# Altium schematic sheet Top Level.SchDoc
size A
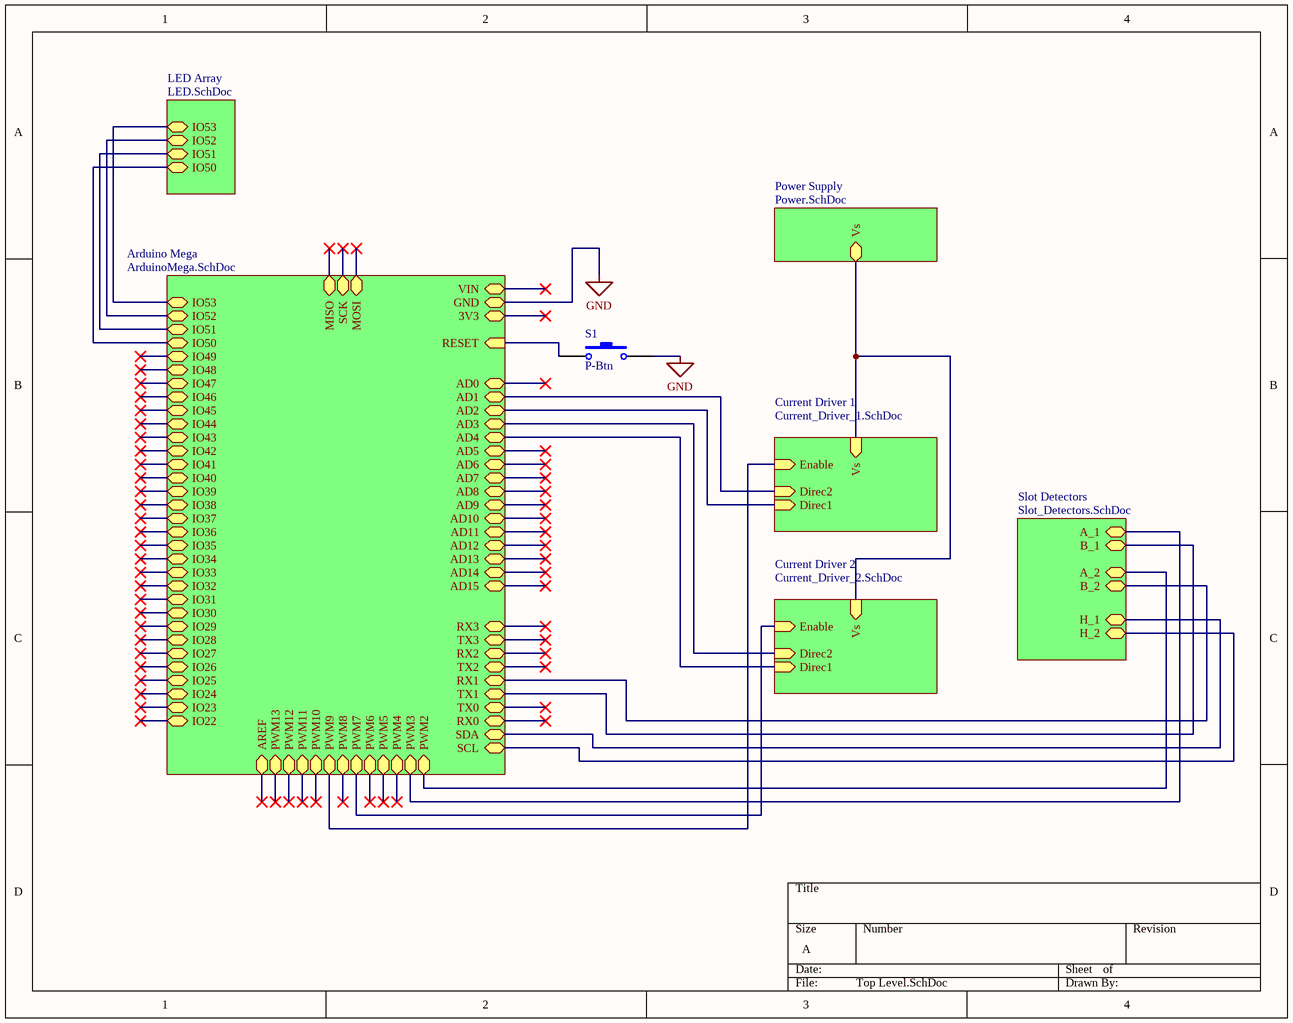
[diagram p0: Top Level.SchDoc]

## Parts
S1  P-Btn  [SPST-2_LGE1.0]

## Sub-sheets
Arduino Mega = ArduinoMega.SchDoc: AD9 (bidir), AD8 (bidir), AD12 (bidir), AD10 (bidir), AD14 (bidir), AD15 (bidir), AD13 (bidir), AD11 (bidir), AD0 (bidir), AD1 (bidir), AD2 (bidir), AD6 (bidir), AD3 (bidir), AD7 (bidir), AD4 (bidir), AD5 (bidir), GND, 3V3, VIN, RESET (in), RX3 (bidir), SDA (bidir), TX2 (bidir), TX0 (bidir), RX0 (bidir), TX1 (bidir), TX3 (bidir), RX1 (bidir), RX2 (bidir), SCL (bidir), MISO (bidir), SCK (bidir), MOSI (bidir), IO52 (bidir), IO50 (bidir), IO51 (bidir), IO53 (bidir), IO46 (bidir), IO44 (bidir), IO45 (bidir), IO43 (bidir), IO41 (bidir), IO47 (bidir), IO49 (bidir), IO42 (bidir), IO40 (bidir), IO48 (bidir), IO33 (bidir), IO34 (bidir), IO32 (bidir), IO29 (bidir), IO39 (bidir), IO31 (bidir), IO28 (bidir), IO27 (bidir), IO25 (bidir), IO23 (bidir), IO30 (bidir), IO26 (bidir), IO22 (bidir), IO24 (bidir), IO38 (bidir), IO35 (bidir), IO37 (bidir), IO36 (bidir), PWM2 (bidir), PWM11 (bidir), PWM8 (bidir), PWM12 (bidir), PWM10 (bidir), PWM13 (bidir), PWM7 (bidir), PWM4 (bidir), PWM5 (bidir), PWM6 (bidir), PWM3 (bidir), AREF (bidir), PWM9 (bidir)
Current Driver 1 = Current_Driver_1.SchDoc: Enable (in), Direc2 (in), Direc1 (in), Vs (in)
Current Driver 2 = Current_Driver_2.SchDoc: Direc1 (in), Enable (in), Direc2 (in), Vs (in)
LED Array = LED.SchDoc: IO53 (bidir), IO52 (bidir), IO51 (bidir), IO50 (bidir)
Power Supply = Power.SchDoc: Vs
Slot Detectors = Slot_Detectors.SchDoc: A_1 (bidir), B_1 (bidir), A_2 (bidir), B_2 (bidir), H_1, H_2

## Nets
GND: S1.2 ; sheet Arduino Mega/GND
NetS1_1: S1.1 ; sheet Arduino Mega/RESET
(unnamed): sheet Current Driver 1/Enable, sheet Arduino Mega/PWM9
(unnamed): sheet Current Driver 1/Direc2, sheet Arduino Mega/AD1
(unnamed): sheet Current Driver 1/Direc1, sheet Arduino Mega/AD2
(unnamed): sheet Current Driver 1/Vs, sheet Current Driver 2/Vs, sheet Power Supply/Vs
(unnamed): sheet Current Driver 2/Direc1, sheet Arduino Mega/AD4
(unnamed): sheet Current Driver 2/Enable, sheet Arduino Mega/PWM7
(unnamed): sheet Current Driver 2/Direc2, sheet Arduino Mega/AD3
(unnamed): sheet Arduino Mega/SDA, sheet Slot Detectors/H_1
(unnamed): sheet Arduino Mega/TX1, sheet Slot Detectors/B_1
(unnamed): sheet Arduino Mega/RX1, sheet Slot Detectors/B_2
(unnamed): sheet Arduino Mega/SCL, sheet Slot Detectors/H_2
(unnamed): sheet Arduino Mega/IO52, sheet LED Array/IO52
(unnamed): sheet Arduino Mega/IO50, sheet LED Array/IO50
(unnamed): sheet Arduino Mega/IO51, sheet LED Array/IO51
(unnamed): sheet Arduino Mega/IO53, sheet LED Array/IO53
(unnamed): sheet Arduino Mega/PWM2, sheet Slot Detectors/A_2
(unnamed): sheet Arduino Mega/PWM3, sheet Slot Detectors/A_1

## Library data of the parts
S1 = P-Btn: Push Button; Published: 24-Mar-1999; LatestRevisionDate: 17-Jul-2002; LatestRevisionNote: Re-released for DXP Platform.; PackageReference: SPST-2; Publisher: Altium Limited; ComponentLink1Description: Datasheet (ELEC391); ComponentLink1URL: http://industrial.panasonic.com/cdbs/www-data/pdf/ATK0000/ATK0000CE11.pdf